# EAGLE design pass_through_adaptor_1_1 (EAGLE 6.6.0)
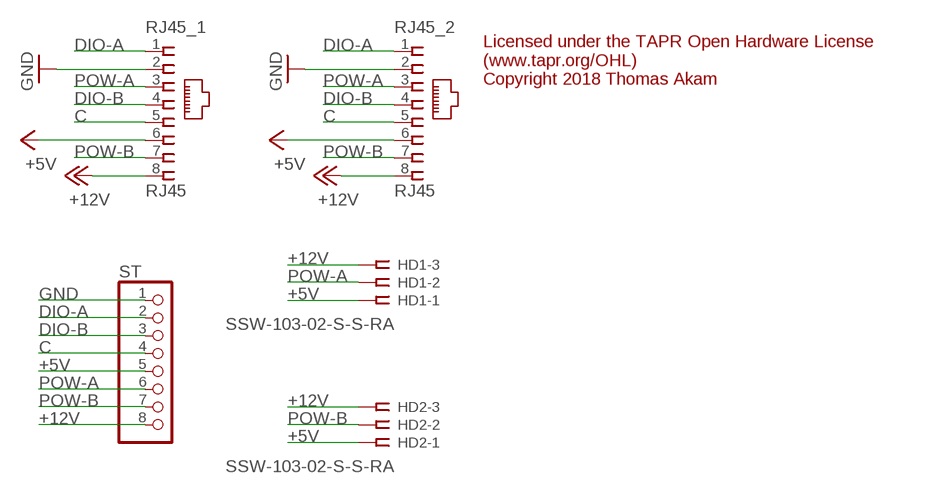
[diagram p0: schematic, sheet 1]

## Parts
HD1  SSW-103-02-S-S-RA  [SSW-103-02-S-S-RA]
HD2  SSW-103-02-S-S-RA  [SSW-103-02-S-S-RA]
RJ45_1  RJ45  RJ45VERTICAL  [RJ45-NO-SHIELD-VERTICAL]
RJ45_2  RJ45  RJ45VERTICAL  [RJ45-NO-SHIELD-VERTICAL]
ST  PINHD-1X8  [1X08]

## Nets
+5V: HD1.1 HD2.1 RJ45_1.6 RJ45_2.6 ST.5
+12V: HD1.3 HD2.3 RJ45_1.8 RJ45_2.8 ST.8
C: RJ45_1.5 RJ45_2.5 ST.4
DIO-A: RJ45_1.1 RJ45_2.1 ST.2
DIO-B: RJ45_1.4 RJ45_2.4 ST.3
GND: RJ45_1.2 RJ45_2.2 ST.1
POW-A: HD1.2 RJ45_1.3 RJ45_2.3 ST.6
POW-B: HD2.2 RJ45_1.7 RJ45_2.7 ST.7

## Notes on the sheet
- Licensed under the TAPR Open Hardware License
  (www.tapr.org/OHL)
  Copyright 2018 Thomas Akam

## Library data of the parts
HD1 HD2 = con-samtec:SSW-103-02-S-S: THROUGH-HOLE .025" SQ POST SOCKET Source: Samtec SSW.pdf; MPN: SSW-103-02-S-S-RA; OC_FARNELL: unknown; OC_NEWARK: 11P9368
RJ45_1 RJ45_2 = con-tycoelectronics-vertical_RJ45:RJ45: CORCOM Modular RJ Jacks No Shield Source: www.tycoelectronics.com .. ENG_DS_1654001_1099_RJ_L_0507.pdf
ST = pinhead:PINHD-1X8: PIN HEADER

## Board
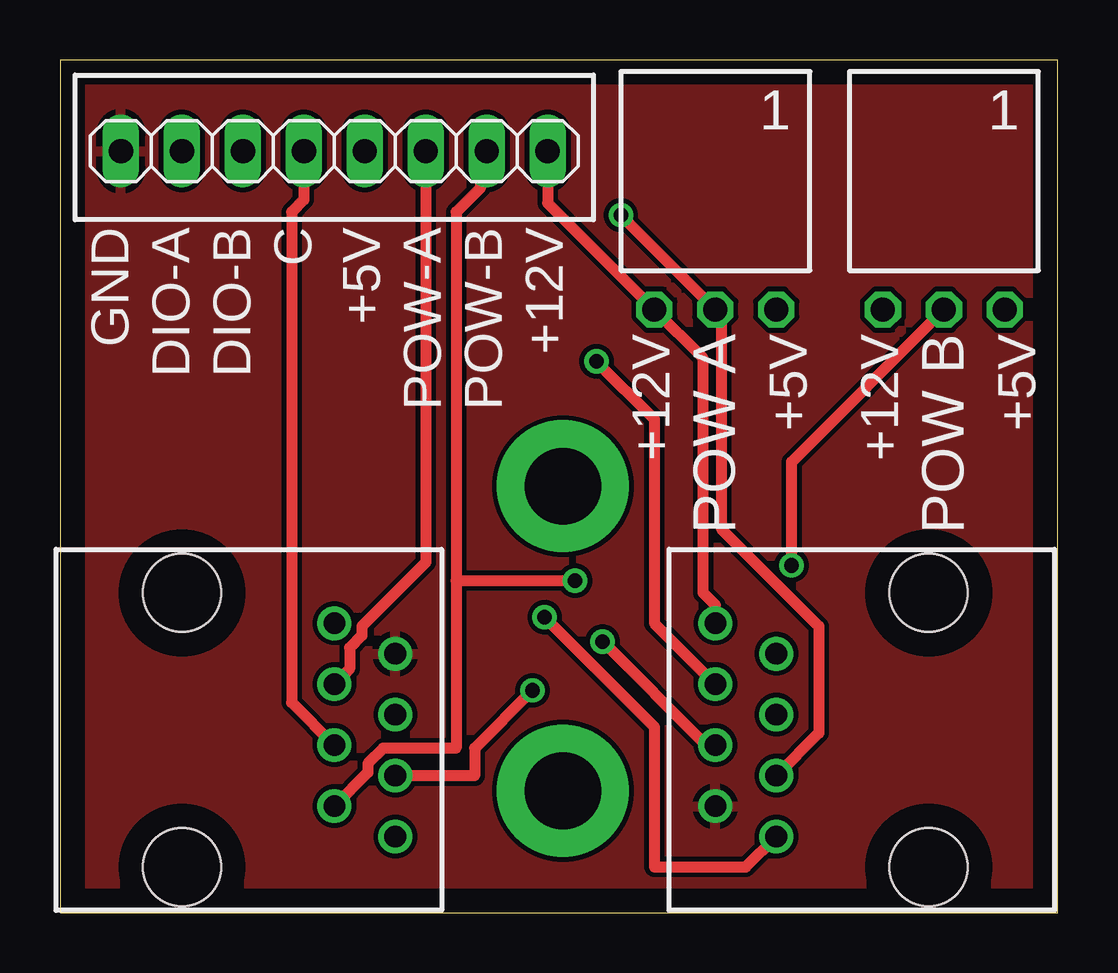
[diagram p1: board, top side]
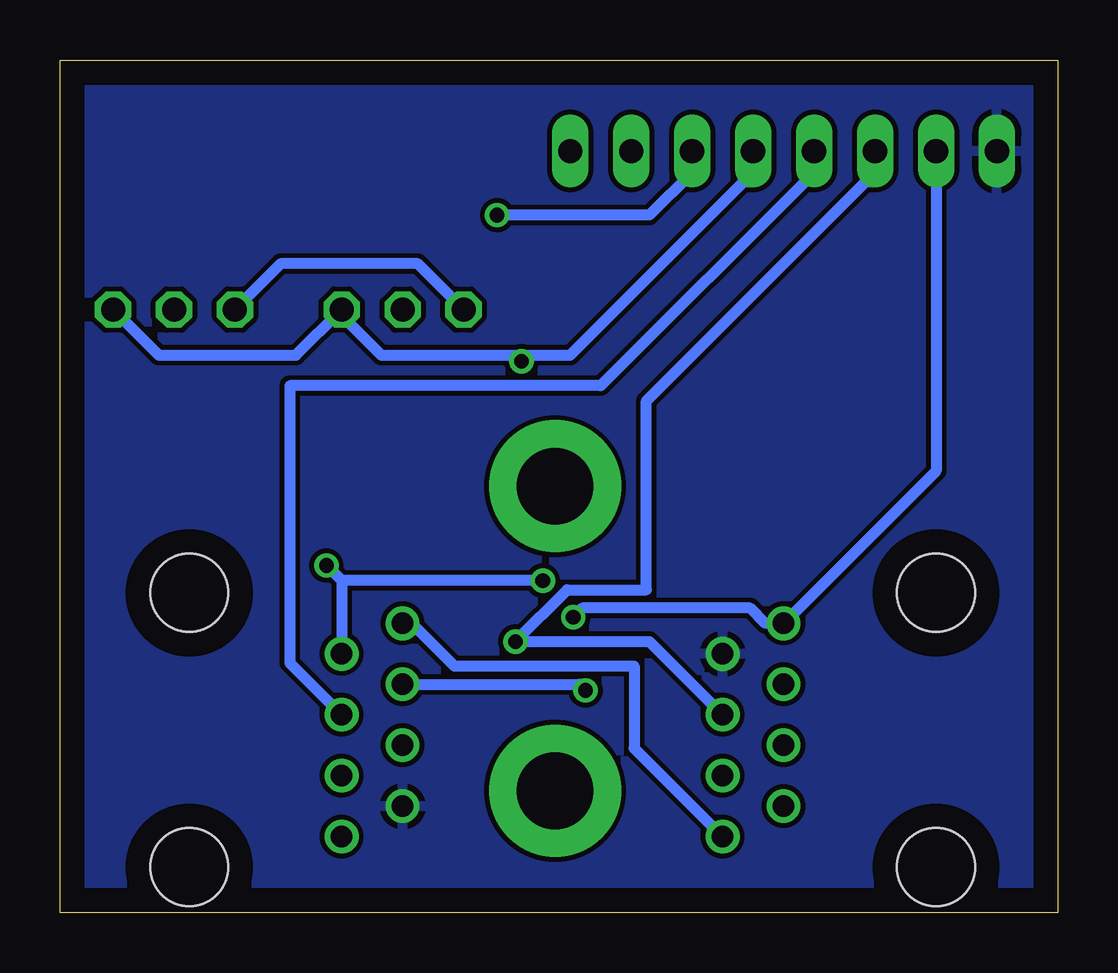
[diagram p2: board, bottom side, seen from below]

Size 41.58 x 35.55 mm. Coordinates in mm from the lower left corner, seen from the top.
Outline: 0,0 41.58,0 41.58,35.55 0,35.55 0,0
Copper layers (1*16): Top 0.035mm / dielectric 1.5mm / Bottom 0.035mm
Design rules "default *": minimum track width 18mil, minimum drill 24mil, track to track 8mil, track to pad 8mil, pad to pad 8mil, via to via 8mil, smd to smd 8mil, copper to edge 40mil, drill to drill 8mil, minimum pad ring 10mil, minimum via ring 8mil, stop-mask expansion 4mil, vias tented up to drill 0mil, thermal gap 10mil
vRestrict: area 0.6,21 to 21,28.6; area 22.9,15.2 to 40.6,26.7

### Footprints (pad centres in the part's own frame; a part is rotated, then mirrored left to right if it is on the bottom)
SSW-103-02-S-S-RA = drill 1 pad 1.5 octagon: 1 -2.54,1.524; 2 0,1.524; 3 2.54,1.524
RJ45-NO-SHIELD-VERTICAL = drill 0.9 pad 1.4: 1 -4.445,5.08; 2 -3.175,7.62; 3 -1.905,5.08; 4 -0.635,7.62; 5 0.635,5.08; 6 1.905,7.62; 7 3.175,5.08; 8 4.445,7.62 | hole 3.251: -5.715,-1.27; 5.715,-1.27
1X08 = drill 1.016 long: 1 -8.89,0; 2 -6.35,0; 3 -3.81,0; 4 -1.27,0; 5 1.27,0; 6 3.81,0; 7 6.35,0; 8 8.89,0

### Placement (x,y rotation side)
HD1  27.3,26.67 180 top
HD2  36.83,26.67 180 top
RJ45_1  6.35,7.62 270 top
RJ45_2  34.92,7.62 90 top
ST  11.43,31.75 0 top

### Tracks (layer width: path | path; a pad name or v marks a point on that pad's centre or on a via)
+5V  (via drill 0.61)
  Top 0.457: RJ45_1.6 17.27,5.71 17.27,6.86 v19.68,9.27 | RJ45_2.6 24.77,12.06 24.77,20.57 v22.35,22.99
  Bottom 0.457: v19.68,9.27 19.94,9.53 RJ45_2.6 | HD2.1 37.47,23.24 31.75,23.24 HD1.1 29.84,24.89 28.19,23.24 22.35,23.24 | ST.5 12.7,30.48 13.08,30.48 20.32,23.24 22.35,23.24 | v22.35,22.99 22.35,23.24
+12V
  Top 0.457: ST.8 20.32,29.59 HD1.3 26.8,23.11 26.8,13.34 27.3,12.83 RJ45_2.8
  Bottom 0.457: HD2.3 32.38,27.05 26.67,27.05 HD1.3 | RJ45_1.8 17.65,6.86 17.65,10.29 25.15,10.29 26.92,12.06 RJ45_2.8
C
  Top 0.457: RJ45_1.5 9.65,8.76 9.65,29.21 10.16,29.72 ST.4
  Bottom 0.457: RJ45_2.5 32,10.41 32,21.97 19.05,21.97 10.16,30.86 ST.4
DIO-A  (via drill 0.61)
  Top 0.457: RJ45_2.1 28.57,1.91 24.77,1.91 24.77,7.75 v20.19,12.32
  Bottom 0.457: ST.2 5.08,18.41 RJ45_1.1 12.19,12.06 12.83,12.7 19.81,12.7 v20.19,12.32
DIO-B  (via drill 0.61)
  Top 0.457: v22.61,11.3 26.92,6.99 RJ45_2.4
  Bottom 0.457: RJ45_1.4 17.02,11.3 v22.61,11.3 20.45,13.46 17.14,13.46 17.14,21.34 8,30.48 7.62,30.48 ST.3
GND
  pour Bottom: 0,0 0,35.56 41.27,35.56 41.27,0
  pour Top: 0,0 0,35.56 41.27,35.56 41.27,0
N$1  (via drill 3.2 pad 5.5)
  other vias: 20.95,5.08
N$2  (via drill 3.2 pad 5.5)
  other vias: 20.95,17.78
POW-A  (via drill 0.61)
  Top 0.457: RJ45_2.3 31.62,7.49 31.62,11.94 27.56,16 27.56,24.51 27.3,24.77 HD1.2 v23.37,29.08 | RJ45_1.3 12.06,10.16 12.06,11.05 12.57,11.56 12.57,11.94 15.24,14.61 ST.6
  Bottom 0.457: v23.37,29.08 17.02,29.08 15.24,30.86 ST.6
POW-B  (via drill 0.61)
  Top 0.457: RJ45_1.7 12.83,5.84 12.83,6.22 13.46,6.86 16.51,6.86 16.51,13.84 | 16.51,13.84 16.51,29.21 17.53,30.23 17.53,30.35 17.78,30.61 ST.7 | 16.51,13.84 v21.46,13.84 | HD2.2 30.48,18.8 v30.48,14.48
  Bottom 0.457: 29.84,13.84 RJ45_2.7 | v21.46,13.84 29.84,13.84 | 29.84,13.84 v30.48,14.48

### Text on the board
tPlace: GND | DIO-A | DIO-B | C | +5V | POW-A | POW-B | +12V | +12V | POW A | +5V | +12V | POW B | +5V
Document: Licensed under the TAPR Open Hardware License / (www.tapr.org/OHL) / Copyright 2018 Thomas Akam